# EAGLE design lipo-charger (EAGLE 9.3.1)
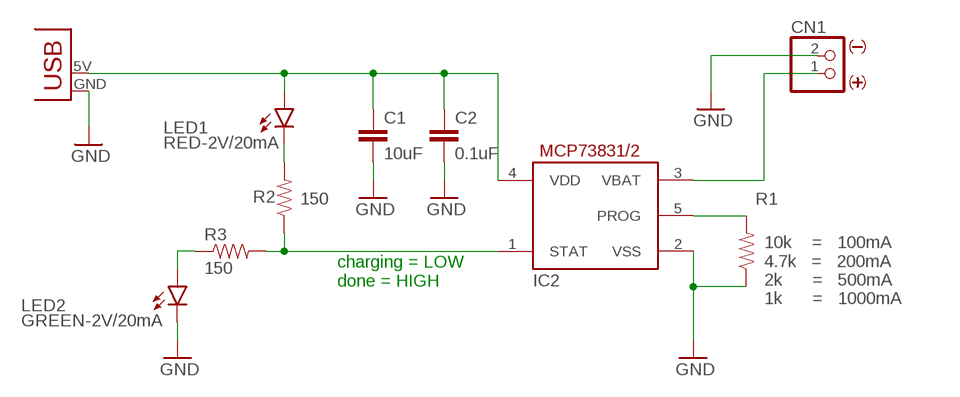
[diagram p0: schematic, sheet 1]

## Parts
C1  10uF  CAP-0805  [0805]
C2  0.1uF  CAP-0805  [0805]
CN1  JST_2PIN_BATTERY-SMT-HORIZ  [JST-PH-2-SMT-RA]
IC2  LIPO_CHARGER/OT  [SOT23-5L]
LED1  RED-2V/20mA  LED-0805  [CHIP-LED0805]
LED2  GREEN-2V/20mA  LED-0805  [CHIP-LED0805]
R1  10k  RESISTOR-0805  [0805]
R2  150  RESISTOR-0805  [0805]
R3  150  RESISTOR-0805  [0805]
U$2  USB-PCB-POWER  [USB-A-PCB-POWER]

## Nets
5V: C1.1 C2.1 IC2.4(VDD) LED1.A U$2.5V(VBUS)
BATTERY: CN1.1 IC2.3(VBAT)
CURRENT-CONTROL: IC2.5(PROG) R1.2
GND: C1.2 C2.2 CN1.2 IC2.2(VSS) LED2.C R1.1 U$2.GND
N$2: LED1.C R2.2
N$3: LED2.A R3.1
STATUS: IC2.1(STAT) R2.1 R3.2

## Notes on the sheet
- charging = LOW
  done = HIGH
- 10k    =   100mA
  4.7k   =   200mA
  2k      =   500mA
  1k      =   1000mA

## Library data of the parts
C1 C2 = homemade-hardware:CAP: Capacitor Standard 0603 ceramic capacitor, and 0.1" leaded capacitor.
CN1 = homemade-hardware:JST_2PIN_BATTERY: JST 2-Pin Connectors of various flavors SMT-HORIZ (S2B-PH-SM4) SMT-VERT (B2B-PH-SM4) DIP-HORIZ (S2B-PH) DIP-VERT (B2B-PH)
IC2 = homemade-hardware:LIPO_CHARGER: MCP73831/2 <https://www.digikey.com/product-detail/en/microchip-technology/MCP73831T-2ATI-OT/MCP73831T-2ATI-OTCT-ND/1979803>: LiPo Battery Charger
LED1 LED2 = homemade-hardware:LED: LEDs Standard schematic elements and footprints for 5mm, 3mm, 1206, and 0603 sized LEDs. 5mm - Spark Fun Electronics SKU : COM-00529 (and others)
R1-R3 = homemade-hardware:RESISTOR: Resistor Basic schematic elements and footprints for 0603, 1206, and PTH resistors.
U$2 = homemade-hardware:USB-PCB-POWER

## Board
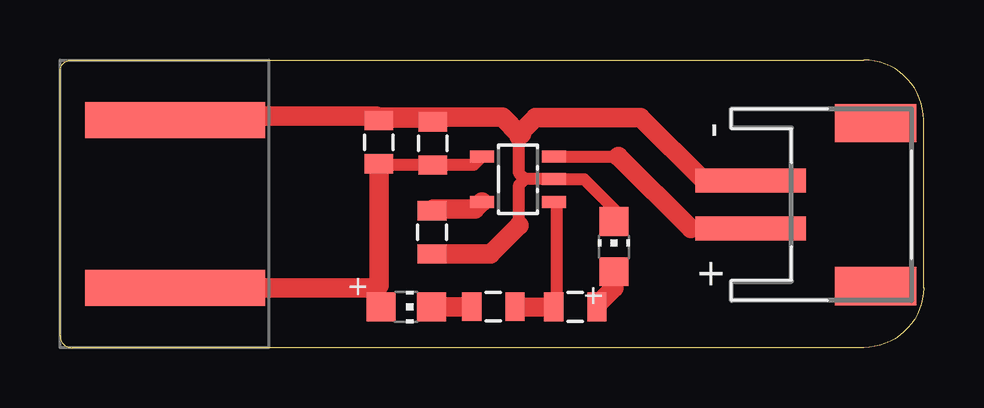
[diagram p1: board, top side]

Size 36 x 12 mm. Coordinates in mm from the lower left corner, seen from the top.
Outline: 0.5,12 33.5,12 arc-90 36,9.5 36,2.5 arc-90 33.5,0 0.5,0 arc-90 0,0.5 0,11.5 arc-90 0.5,12
Copper layers (1*16): Top 0.035mm / dielectric 1.5mm / Bottom 0.035mm
Design rules "default": minimum track width 16mil, minimum drill 0.8mm, track to track 0.8mm, track to pad 0.8mm, pad to pad 0.8mm, via to via 0.8mm, smd to smd 0mil, copper to edge 1mil, drill to drill 1mil, minimum pad ring 10mil, minimum via ring 10mil, stop-mask expansion 1mil, vias tented up to drill 30mil, thermal gap 10mil

### Footprints (pad centres in the part's own frame; a part is rotated, then mirrored left to right if it is on the bottom)
0805 = smd 0.8 x 1.2: 1 -0.9,0; 2 0.9,0
JST-PH-2-SMT-RA = smd 1 x 4.6: 1 1,-3.7; 2 -1,-3.7 | smd 1.6 x 3.4: NC1 -3.4,1.5; NC2 3.4,1.5
SOT23-5L = smd 0.5 x 1: 1 -0.95,-1.5; 2 0,-1.5; 3 0.95,-1.5; 4 0.95,1.5; 5 -0.95,1.5
CHIP-LED0805 = smd 1.2 x 1.2: A 0,-1.05; C 0,1.05
USB-A-PCB-POWER = smd 7.5 x 1.5: 5V -0.2,-3.5; GND -0.2,3.5

### Placement (x,y rotation side)
C1  13.3,8.56 90 top
C2  15.55,8.51 90 top
CN1  32.5,5.96 270 top
IC2  19.1,7.02 90 top
LED1  14.44,1.7 270 top
LED2  23.1,4.21 0 top
R1  15.51,4.8 90 top
R2  18.06,1.7 180 top
R3  21.49,1.7 180 top
U$2  5,6 0 top

### Tracks (layer width: path | path; a pad name or v marks a point on that pad's centre or on a via)
5V
  Top 0.406: 13.21,2.5 13.28,2.56
  Top 0.508: IC2.4 17.24,7.62 C2.1 | C2.1 13.3,7.62 | LED1.A 13.3,1.7 13.3,2.58 13.28,2.56 | C2.1 13.35,7.62 C1.1
  Top 0.813: C1.1 13.3,2.58 | U$2.5V 13.21,2.5
BATTERY
  Top 0.508: IC2.3 23.29,7.97 | 26.3,4.96 CN1.1
  Top 0.813: 23.29,7.97 26.3,4.96
CURRENT-CONTROL
  Top 0.813: IC2.5 17.3,5.77 15.58,5.77 R1.2
GND
  Top 0.508: 19.39,7.02 IC2.2 21.85,7.02 23.1,5.77 LED2.C | 19.39,7.02 19.15,7.26 19.15,8.81 | 19.39,7.02 19.15,6.78 19.15,5.09 | C2.2 13.35,9.41 C1.2 | CN1.2 26.84,6.96
  Top 0.813: 19.2,8.96 19.25,8.91 19.15,8.81 | 26.84,6.96 24.2,9.6 19.83,9.6 19.2,8.96 | 19.2,8.96 19.15,8.91 18.44,9.62 13.45,9.62 C1.2 13.3,9.56 13.2,9.66 4.96,9.66 U$2.GND | 19.15,5.09 17.96,3.9 R1.1
N$2
  Top 0.508: R2.2
  Top 0.813: R2.2 LED1.C
N$3
  Top 0.508: R3.1 22.39,1.78 | 23.1,2.5
  Top 0.813: 22.39,1.78 23.1,2.5 | 23.1,2.5 LED2.A
STATUS
  Top 0.508: 19.07,1.68 R2.1 | IC2.1 20.7,5.97 20.7,1.81 R3.2
  Top 0.813: R3.2 19.07,1.68